# EAGLE design WindVane_1 (EAGLE 7.6.0)
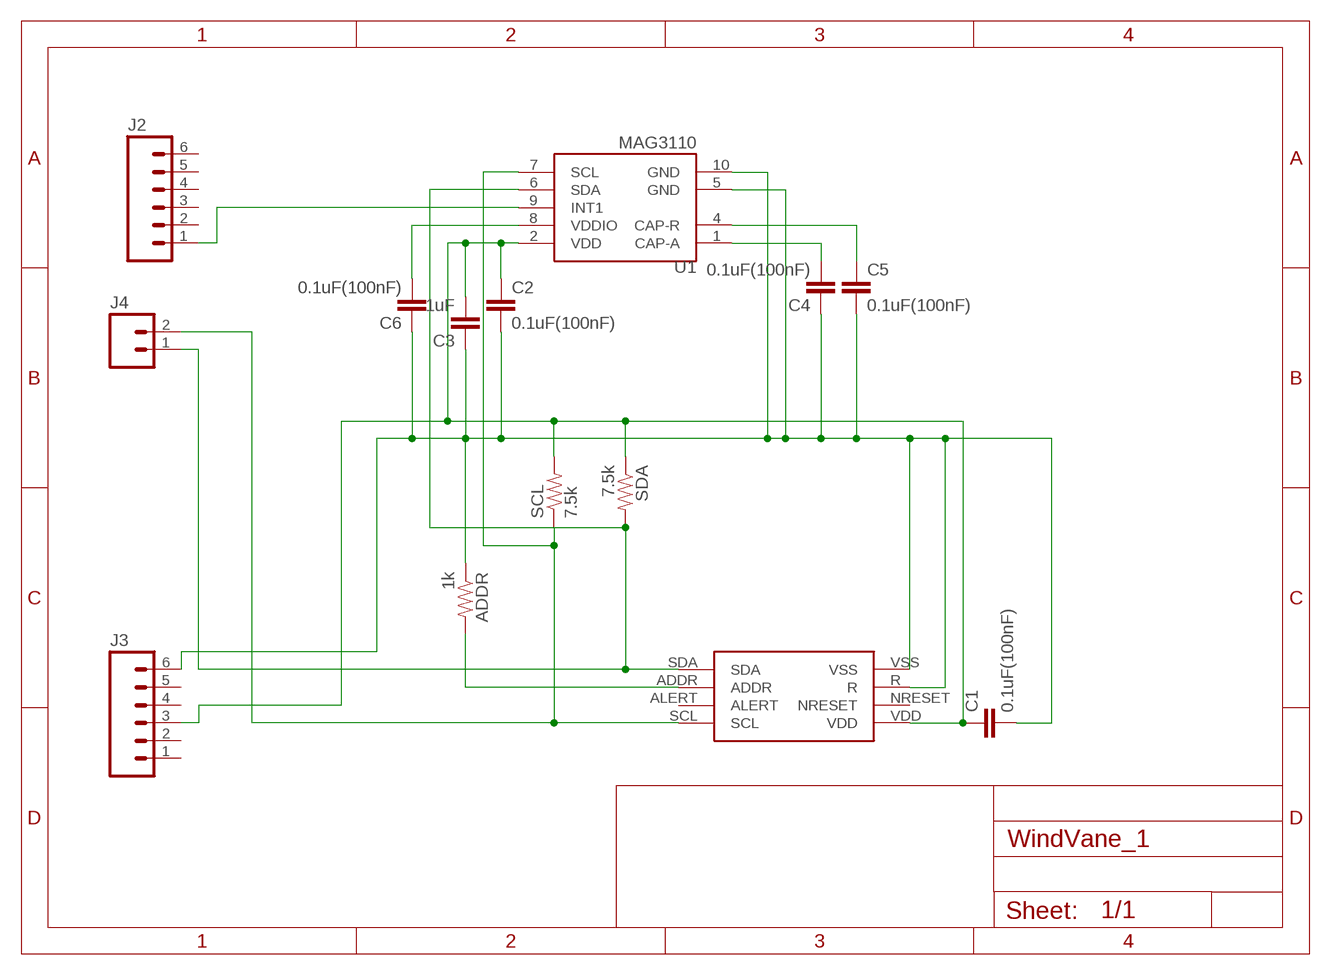
[diagram p0: schematic, sheet 1]

## Parts
ADDR  1k  RESISTOR1206  [1206]
C1  0.1uF(100nF)  CAP0603-CAP  [0603-CAP]
C2  0.1uF(100nF)  0.1UF-25V(+80/-20%)(0603)  [0603-CAP]
C3  1uF  CAP0402-CAP  [0402-CAP]
C4  0.1uF(100nF)  0.1UF-25V(+80/-20%)(0603)  [0603-CAP]
C5  0.1uF(100nF)  0.1UF-25V(+80/-20%)(0603)  [0603-CAP]
C6  0.1uF(100nF)  0.1UF-25V(+80/-20%)(0603)  [0603-CAP]
J2  M06NO_SILK_YES_STOP  [1X06_NO_SILK_YES_STOP]
J3  M06NO_SILK_YES_STOP  [1X06_NO_SILK_YES_STOP]
J4  M02PTH  [1X02]
SCL  7.5k  RESISTOR1206  [1206]
SDA  7.5k  RESISTOR1206  [1206]
U1  MAG3110  [DFN-10]
U$1  SHT3X-DISSURFACE_MOUNT  [SHT3X-DIS]

## Nets
N$1: J4.1 SDA.2 U1.6(SDA) U$1.SDA
N$2: C1.1 C2.1 C3.2 J3.3 SCL.2 SDA.1 U1.2(VDD) U$1.VDD
N$3: ADDR.1 C1.2 C2.2 C3.1 C4.1 C5.2 C6.1 J3.6 U1.5(GND) U1.10(GND) U$1.R U$1.VSS
N$4: J4.2 SCL.1 U1.7(SCL) U$1.SCL
N$5: ADDR.2 U$1.ADDR
N$6: C4.2 U1.1(CAP-A)
N$7: J2.1 U1.9(INT1)
N$8: C6.2 U1.8(VDDIO)
N$9: C5.1 U1.4(CAP-R)
Unconnected: J2.2 J2.3 J2.4 J2.5 J2.6 J3.1 J3.2 J3.4 J3.5 U$1.ALERT U$1.NRESET

## Library data of the parts
ADDR SCL SDA = SparkFun-Passives:RESISTOR: Resistor Basic schematic elements and footprints for 0603, 1206, and PTH resistors.
C1 = SparkFun-Passives:CAP: Capacitor Standard 0603 ceramic capacitor, and 0.1" leaded capacitor.
C2 C4-C6 = SparkFun-Capacitors:0.1UF-25V(+80/-20%)(0603): CAP-00810 Ceramic Standard decoupling cap; PROD_ID: CAP-00810; VALUE: 0.1uF
C3 = SparkFun-Capacitors:CAP: Capacitor Standard 0603 ceramic capacitor, and 0.1" leaded capacitor.
J2 J3 = SparkFun-Connectors:M06: Header 6 Standard 6-pin 0.1" header. Use with straight break away headers (SKU : PRT-00116), right angle break away headers (PRT-00553), swiss pins (PRT-00743), machine pins (PRT-00117), and female headers (PRT-00115). Molex polarized connector foot print use with SKU : PRT-08094 with associated crimp pins and housings. NOTES ON THE VARIANTS LOCK and LOCK_LONGPADS... This footprint was designed to help hold the alignment of a through-hole component (i.e. 6-pin header) while soldering it into place. You may notice that each hole has been shifted either up or down by 0.005 of an inch from it's more standard position (which is a perfectly straight line). This slight alteration caused the pins (the squares in the middle) to touch the edges of the holes. Because they are alternating, it causes a "brace" to hold the component in place. 0.005 has proven to be the perfect amount of "off-center" position when using our standard breakaway headers. Although looks a little odd when you look at the bare footprint, once you have a header in there, the alteration is very hard to notice. Also,if you push a header all the way into place, it is covered up entirely on the bottom side. This idea of altering the position of holes to aid alignment will be further integrated into the Sparkfun Library for other footprints. It can help hold any component with 3 or more connection pins.
J4 = SparkFun-Connectors:M02: Standard 2-pin 0.1" header. Use with - straight break away headers ( PRT-00116) - right angle break away headers (PRT-00553) - swiss pins (PRT-00743) - machine pins (PRT-00117) - female headers (PRT-00115) Molex polarized connector foot print use with: PRT-08233 with associated crimp pins and housings. 2.54_SCREWTERM for use with PRT-10571. 3.5mm Screw Terminal footprints for PRT-08084 5mm Screw Terminal footprints for use with PRT-08432
U1 = SparkFun-Sensors:MAG3110: 3-axis digital (I2C) magnetometer
U$1 = WindVane:SHT3X-DIS

## Board
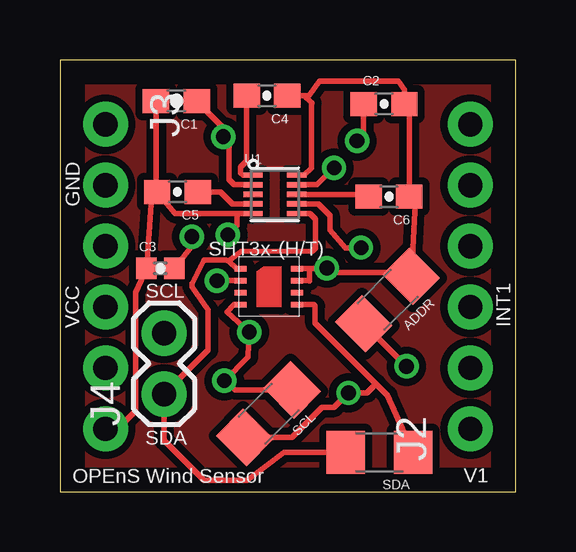
[diagram p1: board, top side]
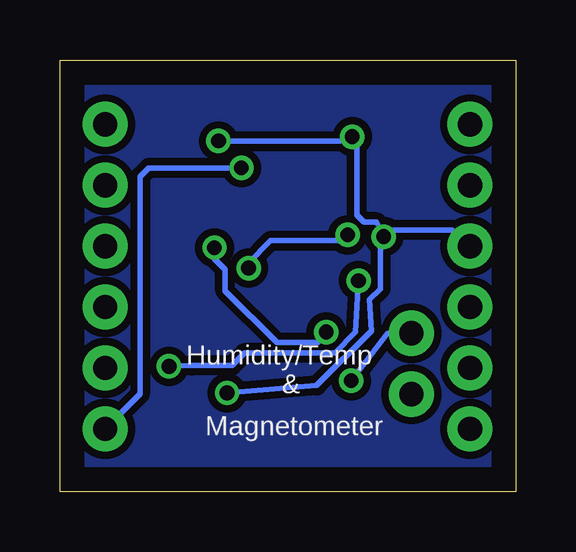
[diagram p2: board, bottom side, seen from below]

Size 19 x 18 mm. Coordinates in mm from the lower left corner, seen from the top.
Outline: 0,0 19,0 19,18 0,18 0,0
Copper layers (1*16): Top 0.035mm / dielectric 1.5mm / Bottom 0.035mm
Design rules "default": minimum track width 10mil, minimum drill 24mil, track to track 8mil, track to pad 8mil, pad to pad 8mil, via to via 8mil, smd to smd 8mil, copper to edge 40mil, drill to drill 8mil, minimum pad ring 10mil, minimum via ring 8mil, stop-mask expansion 4mil, vias tented up to drill 0mil, thermal gap 10mil

### Footprints (pad centres in the part's own frame; a part is rotated, then mirrored left to right if it is on the bottom)
1206 = smd 1.6 x 1.8: 1 -1.4,0; 2 1.4,0
0603-CAP = smd 1.1 x 1: 1 -0.85,0; 2 0.85,0
0402-CAP = smd 0.85 x 0.9: 1 -0.58,0; 2 0.58,0
1X06_NO_SILK_YES_STOP = drill 1.016 pad 1.88: 1 0,0; 2 2.54,0; 3 5.08,0; 4 7.62,0; 5 10.16,0; 6 12.7,0
1X02 = drill 1.016 pad 1.88: 1 0,0; 2 2.54,0
DFN-10 = smd 0.8 x 0.22: 1 -0.91,0.8; 2 -0.91,0.4; 3 -0.91,0; 4 -0.91,-0.4; 5 -0.91,-0.8; 6 0.91,-0.8; 7 0.91,-0.4; 8 0.91,0; 9 0.91,0.4; 10 0.91,0.8
SHT3X-DIS = smd 0.55 x 0.25: ADDR 0.075,1.5; ALERT 0.075,1; NRESET 2.425,1; R 2.425,1.5; SCL 0.075,0.5; SDA 0.075,2; VDD 2.425,0.5; VSS 2.425,2

### Placement (x,y rotation side)
ADDR  13.66,7.99 225 top
C1  4.85,16.29 180 top
C2  13.52,16.17 0 top
C3  4.19,9.31 0 top
C4  8.63,16.51 180 top
C5  4.9,12.5 180 top
C6  13.72,12.3 180 top
J2  17.11,2.62 90 top
J3  1.9,15.32 270 top
J4  4.34,4.06 90 top
SCL  8.7,3.25 225 top
SDA  13.32,1.64 180 top
U1  8.96,12.39 0 top
U$1  7.46,7.29 0 top

### Tracks (layer width: path | path; a pad name or v marks a point on that pad's centre or on a via)
GND
  pour Top (isolate 0.305): 0,0 0,18 19,18 19,0
  pour Bottom (isolate 0.305): 0,0 0,18 19,18 19,0
N$1
  Top 0.225: U1.6 10.43,11.6 10.65,11.38 10.65,10.15 10.53,10.04 7.55,10.01 7.03,9.62 | SDA.2 9.35,1.64 7.8,0.46 6.02,0.46 4.34,2.13 J4.1 6.18,5.9 6.18,7.58 5.52,8.53 5.52,8.67 6.01,9.65 6.92,9.66 7.03,9.62 | U$1.SDA 7.36,9.29 7.03,9.62
N$2  (via drill 0.61)
  Top 0.225: 10.58,7.8 10.58,7.79 | 10.58,7.79 U$1.VDD | C2.1 12.67,14.9 v12.39,14.62 | 5.47,10.91 v5.5,10.63 5.47,10.19 C3.2 | SDA.1 13.66,4.01 13.18,4.49 | 13.18,4.49 10.64,7.03 10.64,7.73 10.58,7.79 | 13.18,4.49 12.8,4.12 v12.03,4.12 11.43,3.52 10.94,3.52 9.68,2.26 SCL.2 | U1.2 7.26,12.79 7.04,13.02 7.04,14.57 v6.81,14.8 6.81,15.18 C1.1
  Bottom 0.225: v12.39,14.62 6.99,14.62 v6.81,14.8 | 6.91,14.71 v6.81,14.8 | v12.03,4.12 8.3,4.42 6.01,6.71 6.09,8 5.63,8.46 5.63,10.74 | v6.81,14.8 6.62,14.61 6.62,11.53 6.32,11.23 5.79,11.23 v5.5,10.63 5.49,10.91 2.66,10.91 1.99,10.24 J3.3
  Bottom 0.254: 5.63,10.74 v5.5,10.63
N$3  (via drill 0.61)
  Top 0.225: ADDR.1 14.82,12.04 | C6.1 14.57,15.96 | C2.2 14.37,16.76 14.12,17.11 10.82,17.11 10.38,16.51 10.19,16.51 | C1.2 4,12.55 | J3.6 2.41,2.62 3.15,3.37 3.15,8.3 C3.1 3.83,12.28 C5.2 4.81,11.6 6.17,11.6 6.32,11.6 7.39,11.6 | U$1.R 10.4,8.79 | 10.4,8.79 | 10.4,8.79 10.4,9.3 | 10.4,9.3 U$1.VSS | U1.10 | 10.4,9.3 11.12,9.3 v11.13,9.32 11.35,9.14 14.55,9.14 | 7.39,11.6 | 7.39,11.6 U1.5 | 10.5,16.2 10.48,16.21 | 10.48,16.21 10.19,16.51 | 10.19,16.51 C4.1 | U1.10 10.18,13.2 10.48,13.49 10.48,16.21 | 7.39,11.6 7.39,11.09 v7,10.71
  Top 0.25: 14.82,12.04 C6.1 | 14.57,15.96 C2.2 | 4,12.55 C5.2
  Top 0.254: 14.55,9.14 ADDR.1
  Bottom 0.225: v11.13,9.32 11.13,9.54 10.21,10.46 7.25,10.46 v7,10.71
N$4  (via drill 0.6, 0.61)
  Top 0.225: U1.7 10.78,11.99 11.26,11.52 11.26,10.91 11.9,10.16 v12.54,10.16 v12.55,10.17 | SCL.1 7.31,4.24 v6.86,4.62 7.85,5.61 v7.89,6.66 6.96,7.5 7.26,7.79 U$1.SCL
  Bottom 0.225: v7.89,6.66 8.24,6.22 9.95,6.21 12.11,8.38 12.11,9.26 12.55,9.71 v12.55,10.17 | J4.2 5.35,6.6 v6.86,4.62
N$5  (via drill 0.61)
  Top 0.225: U$1.ADDR 6.76,8.79 v6.55,8.79 | v14.45,5.22 13.89,5.78 ADDR.2
  Bottom 0.225: v6.55,8.79 6.67,6.65 7.54,5.78 11.31,5.78 11.83,5.26 13.51,5.26 v14.45,5.22
N$6
  Top 0.225: U1.1 7.62,13.2 7.54,13.29 7.54,13.54 7.78,13.78 C4.2
N$7  (via drill 0.6)
  Top 0.225: U1.9 10.72,12.79 v11.43,13.5
  Bottom 0.225: v11.43,13.5 15.29,13.5 15.66,13.13 15.66,4.07 J2.1
N$8
  Top 0.225: U1.8 12.77,12.39 C6.2
N$9
  Top 0.225: 5.77,12.48 C5.1 6.7,12.49 7.19,11.99 U1.4

### Text on the board
tPlace: GND | SCL | VCC | INT1 | SDA | OPEnS Wind Sensor | V1
bPlace: Humidity/Temp | & | Magnetometer